# Altium schematic sheet 5V.SchDoc
size A4; SheetNumber: 2; SheetTotal: 4
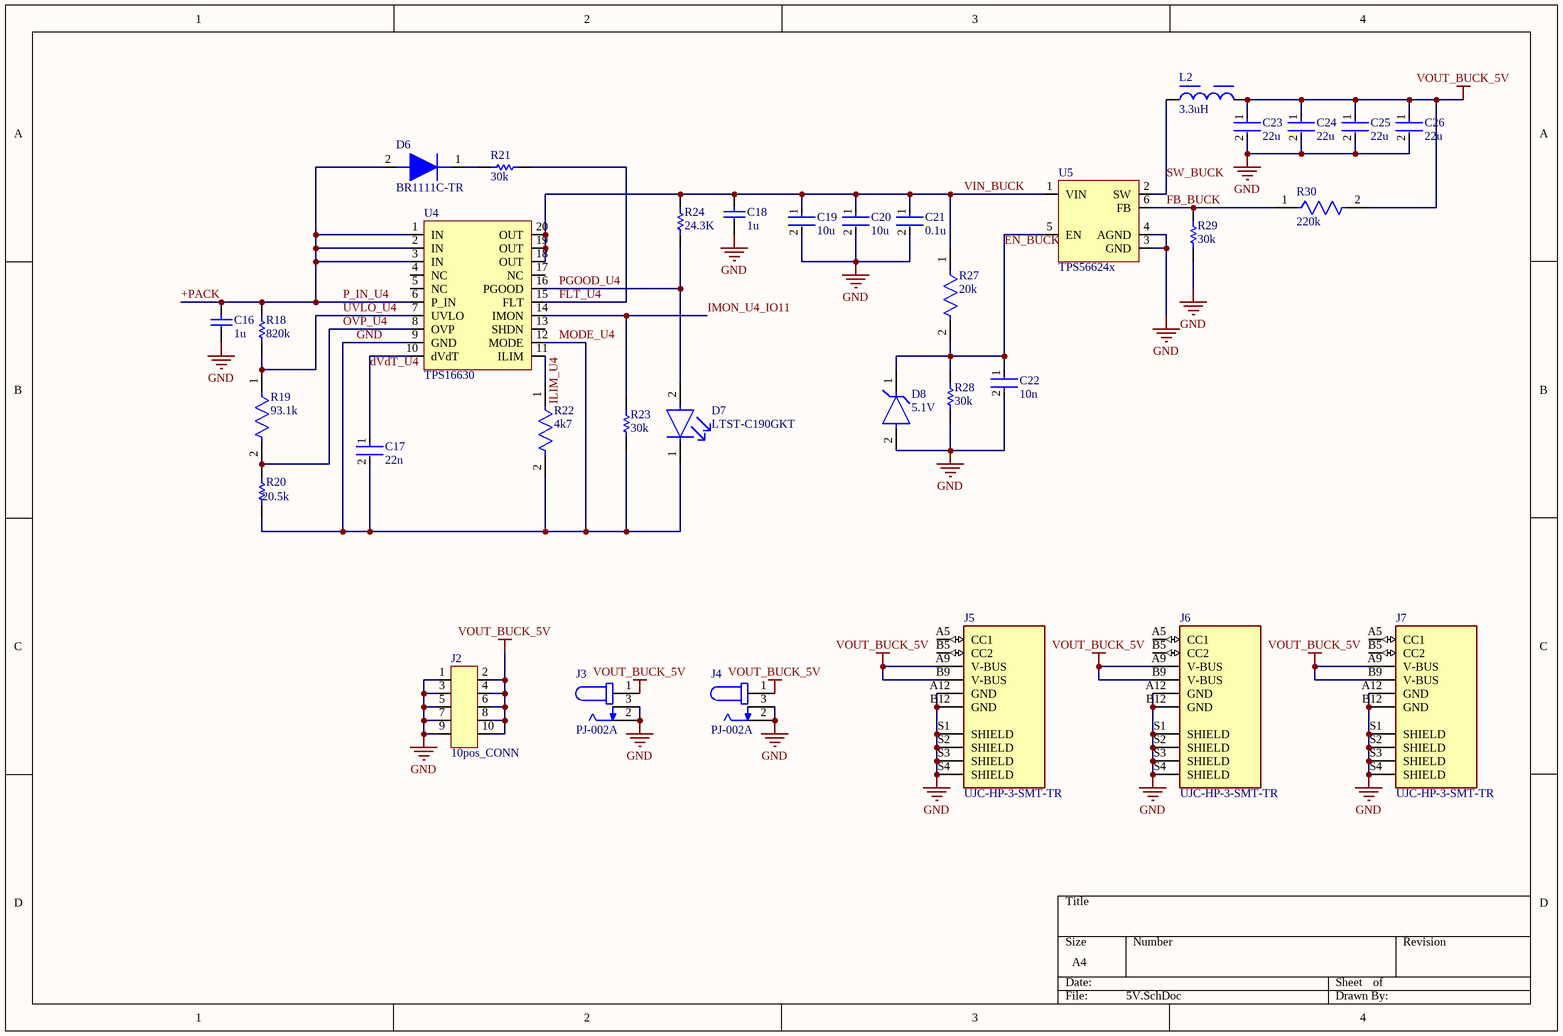
[diagram p0: 5V.SchDoc]

## Parts
C16  1u  [CAPC2013X140X50ML20T25]
C17  22n  [FP-C0603C-CF-MFG]
C18  1u  [CAPC2013X140X50ML20T25]
C19  10u  [FP-GRM21B-0_15-IPC_A]
C20  10u  [FP-GRM21B-0_15-IPC_A]
C21  0.1u  [FP-C0603C-CF-MFG]
C22  10n  [FP-C1608-080-0_1-MFG]
C23  22u  [FP-GRM21B-0_2-e0_2_0_7-IPC_C]
C24  22u  [FP-GRM21B-0_2-e0_2_0_7-IPC_C]
C25  22u  [FP-GRM21B-0_2-e0_2_0_7-IPC_C]
C26  22u  [FP-GRM21B-0_2-e0_2_0_7-IPC_C]
D6  BR1111C-TR  [LED_APHD1608LVBC/D]
D7  LTST-C190GKT  [FP-LTST-C190GKT-MFG]
D8  5.1V  [FP-SOD123-MFG]
J2  10pos_CONN  [61301021121]
J3  PJ-002A  [CUI_PJ-002A]
J4  PJ-002A  [CUI_PJ-002A]
J5  UJC-HP-3-SMT-TR  [CUI_UJC-HP-3-SMT-TR]
J6  UJC-HP-3-SMT-TR  [CUI_UJC-HP-3-SMT-TR]
J7  UJC-HP-3-SMT-TR  [CUI_UJC-HP-3-SMT-TR]
L2  3.3uH  [WE-HCI_1050]
R18  820k  [RESC1608X55X30ML15T15]
R19  93.1k  [FP-CR0805-IPC_B]
R20  20.5k  [RESC2013X60X40LL20T25]
R21  30k  [RESC1609X50X30ML10T20]
R22  4k7  [FP-RC1206-0_65-IPC_B]
R23  30k  [RESC1609X50X30ML10T20]
R24  24.3K  [RESC1609X50X30NL10T20]
R27  20k  [FP-CRCW0603-e3-IPC_C]
R28  30k  [RESC1609X50X30LL10T20]
R29  30k  [RESC1609X50X30LL10T20]
R30  220k  [FP-CRCW0603-HPe3-IPC_C]
U4  TPS16630  [SOP65P640X110-21N]
U5  TPS56624x  [SOT23_6pin]

## Nets
GND: C16.1 C17.2 C18.1 C19.2 C20.2 C21.2 C22.2 C23.2 C24.2 C25.2 C26.2 D7.1(C) D8.2(A) J2.1 J2.3 J2.5 J2.7 J2.9 J3.2 J3.3 J4.2 J4.3 J5.A12(GND) J5.B12(GND) J5.S1(SHIELD) J5.S2(SHIELD) J5.S3(SHIELD) J5.S4(SHIELD) J6.A12(GND) J6.B12(GND) J6.S1(SHIELD) J6.S2(SHIELD) J6.S3(SHIELD) J6.S4(SHIELD) J7.A12(GND) J7.B12(GND) J7.S1(SHIELD) J7.S2(SHIELD) J7.S3(SHIELD) J7.S4(SHIELD) R20.1 R22.2 R23.1 R28.1 R29.1 U4.9(GND) U4.12(MODE) U5.3(GND) U5.4(AGND)  [also labelled MODE_U4]
VOUT_BUCK_5V: C23.1 C24.1 C25.1 C26.1 J2.2 J2.4 J2.6 J2.8 J2.10 J3.1 J4.1 J5.A9(V-BUS) J5.B9(V-BUS) J6.A9(V-BUS) J6.B9(V-BUS) J7.A9(V-BUS) J7.B9(V-BUS) L2.2 R30.2
+PACK: C16.2 D6.2 R18.2 U4.1(IN) U4.2(IN) U4.3(IN) U4.6(P_IN)  [also labelled P_IN_U4]
dVdT_U4: C17.1 U4.10(dVdT)
EN_BUCK: C22.1 D8.1(C) R27.2 R28.2 U5.5(EN)
FB_BUCK: R29.2 R30.1 U5.6(FB)
FLT_U4: R21.1 U4.15(FLT)
ILIM_U4: R22.1 U4.11(ILIM)
IMON_U4_IO11: R23.2 U4.14(IMON)
OVP_U4: R19.2 R20.2 U4.8(OVP)
PGOOD_U4: D7.2(A) R24.1 U4.16(PGOOD)
SW_BUCK: L2.1 U5.2(SW)
UVLO_U4: R18.1 R19.1 U4.7(UVLO)
VIN_BUCK: C18.2 C19.1 C20.1 C21.1 R24.2 R27.1 U4.18(OUT) U4.19(OUT) U4.20(OUT) U5.1(VIN)
NetD6_1: D6.1 R21.2

Not connected (* = marked no-connect by the designer): J5 A5(CC1) B5(CC2); J6 A5(CC1) B5(CC2); J7 A5(CC1) B5(CC2); U4 4(NC) 5(NC) 13(SHDN) 17(NC)

## Library data of the parts
C16 C18 = CMP-2007-03236-1: Manufacturer: Kemet; Part Number: C0805C105K5RACTU
C17 = CMP-2006-03139-2: Ceramic Capacitor 0.022Uf 16V, X7R, 10%, 0603, Full Reel; Manufacturer Part Number: C0603C223K4RACTU; Manufacturer: KEMET; Capacitance: 22,000 pF; Temperature Coefficient: 30ppm/°C; Automotive Grade: Grade 1; Value: 22,000 pF; Tolerance: 0.1; Category: Cap; RoHS: TRUE; Temperature Range High: +125°C; Octopart: https://octopart.com/c0603c223k4ractu-kemet-123286; Mouser Description: CAP CER 0.022UF 16V X7R 0603; Voltage Rating: 16 V; Device Class L1: Passive Components; Automotive: Yes; Height: 0.87mm; Device Class L3: Ceramic Capacitors; Package: C0603C-CF; Temperature Characteristic: X7R; Device Class L2: Capacitors; Material: Ceramic; Lead Free: Yes; ComponentLink2URL: https://api.kemet.com/component-edge/download/datasheet/C0603C100J5GACAUTO.pdf; Temperature Range Low: -55°C; Digikey Description: Ceramic Capacitor 0.022Uf 16V, X7R, 10%, 0603, Full Reel; Temperature: -55°C to +125°C; ComponentLink2Description: Datasheet
C19 C20 = CMP-06035-013048-1: Chip Multilayer Ceramic Capacitors for General Purpose, 0805, 10uF, X5R, 15%, 20%, 25V; Max Operating Temperature: 85°C; Package Quantity: 3000; Case/Package: 0805; Depth: 1.25mm; Case Code (Imperial): 0805; Termination: SMD/SMT; Width: 0.049inch; Packaging: Tape and Reel; Tolerance: 20%; Height: 1.25mm; Min Operating Temperature: -55°C; Capacitance: 10uF; Weight: 0.000335oz; Voltage Rating (DC): 25V; Dielectric: X5R; Length: 2mm; Thickness: 0.055inch; Voltage Rating: 25V; Resistor Type: Ceramic; Lead Free: Lead Free; Case Code (Metric): 2012; Mount: Surface Mount; REACH SVHC: No SVHC
C21 = CMP-03020-003352-2: CAP CER 0.1UF 25V X7R 0603; Manufacturer: KEMET; Manufacturer Part Number: C0603C104J3RACAUTO; Value: 0.10 μF; Temperature Coefficient: 30ppm/°C; Automotive Grade: Grade 1; Tolerance: 0.05; Material: Ceramic; Temperature: -55°C to +125°C; Device Class L2: Capacitors; Device Class L1: Passive Components; Package: C0603C-CF; Octopart: https://octopart.com/c0603c104j3racauto-kemet-20761058; Temperature Range High: +125°C; Temperature Range Low: -55°C; Voltage Rating: 25 V; Height: 0.87mm; ComponentLink2URL: https://api.kemet.com/component-edge/download/datasheet/C0603C100J5GACAUTO.pdf; Automotive: Yes; Temperature Characteristic: X7R; RoHS: TRUE; Capacitance: 0.10 μF; Device Class L3: Ceramic Capacitors; Lead Free: Yes; Mouser Description: Cap Ceramic 0.1uF 25V X7R 5% Pad SMD 0603 125C Automotive T/R; ComponentLink2Description: Datasheet; Category: Cap; Digikey Description: CAP CER 0.1UF 25V X7R 0603
C22 = CMP-2000-06026-2: Multilayer Ceramic Capacitors 10nF ±10% 50V X7R SMD 0603; Voltage: 50V; Depth: 0.8mm; REACH SVHC: No SVHC; Packaging: Tape and Reel; Dielectric Material: Ceramic; Dielectric: X7R; Min Operating Temperature: -55°C; Package Quantity: 1; Width: 0.031inch; Case Code (Imperial): 0603; Radiation Hardening: No; Length: 1.6mm; RoHS Compliant: Yes; Tolerance: 10%; Termination: SMD/SMT; Mount: Surface Mount; Construction: Flat; Resistor Type: Ceramic; Max Operating Temperature: 125°C; Series: C; Lead Free: Lead Free; Capacitance: 10nF; Voltage Rating (DC): 50V; Thickness: 0.037inch; Voltage Rating: 50V; Height: 0.8mm; Weight: 7.1E-05oz; Case/Package: 0603; Case Code (Metric): 1608
C23-C26 = CMP-06035-039918-1: Chip Multilayer Ceramic Capacitors for General Purpose, 0805, 22uF, X5R, 15%, 20%, 10V; Dissipation Factor: 0.035%; Min Operating Temperature: -55°C; Voltage Rating (DC): 10V; Height: 1.25mm; Depth: 1.25mm; Max Operating Temperature: 85°C; Width: 1.25mm; Lead Free: Lead Free; Dielectric Material: Ceramic; Weight: 0.000335oz; Tolerance: 20%; Voltage Rating: 10V; Case Code (Metric): 2012; Termination: SMD/SMT; Length: 2mm; Thickness: 0.057inch; Case/Package: 0805; Packaging: Tape and Reel; Voltage: 10V; Case Code (Imperial): 0805; Resistor Type: Ceramic; Package Quantity: 3000; Mount: Surface Mount; Capacitance: 22uF; Dielectric: X5R
D7 = CMP-22017-000005-2: LED GREEN CLEAR CHIP SMD; Dominant Wavelength: 569nm; Reverse Voltage: 5V; Lens Color: Colorless; Viewing Angle: 130°; Voltage: 2V; Forward Current: 30mA; Power Dissipation: 100mW; Luminous Intensity: 6mcd; Number of LEDs: 1; Forward Voltage: 2.1V; Wavelength: 565nm; Test Current: 10mA; Min Operating Temperature: -55°C; Lens Style: Clear; Mount: Surface Mount; Width: 0.8mm; Packaging: Tape and Reel; Lens Transparency: Clear; Case Code (Metric): 1608; Depth: 0.8mm; Case Code (Imperial): 0603; Case/Package: 0603; Number of Pins: 2; Max Operating Temperature: 85°C; Lead Free: Lead Free; Number of Elements: 1; Length: 1.6mm; Height: 0.8mm; Package Quantity: 1; Power Rating: 100mW; Radiation Hardening: No; Illumination Color: Green; Color: Green
D8 = CMP-12792-000005-1: DIODE ZENER 5.1V 500MW SOD123; Manufacturer: Diodes; Manufacturer Part Number: MMSZ5231B-7-F; Standoff Height: 0mm; Max Zener Voltage: 5.36V; Max Reverse Leakage Current: 5uA; Max Junction Temp: +150°C; Power Dissipation: 370mW; Zener Impedance: 17Ω; Temperature: -65°C to +150°C; RoHS: TRUE; ComponentLink2Description: Datasheet; Octopart: https://octopart.com/mmsz5231b-7-f-diodes+inc.-55400050; Height: 1.45mm; ComponentLink2URL: https://www.diodes.com/assets/Datasheets/ds18010.pdf; Footprint Url: https://www.diodes.com/assets/Package-Files/SOD123.pdf; Device Class L2: Diodes; Nom Zener Voltage: 5.1V; Temperature Range Low: -65°C; Mouser Description: Zener Diodes 5.1V 500mW; Digikey Description: DIODE ZENER 5.1V 500MW SOD123; Device Class L1: Discrete Semiconductors; Device Class L3: Zener Diodes; Lead Free: Yes; Category: Diode; Automotive: No; Package: SOD123; Temperature Range High: +150°C
J3 J4 = PJ-002A: 2.0 x 6.5 mm, 2.5 A, Horizontal, Through Hole, Dc Power Jack Connector; MF: CUI Devices; MP: PJ-002A; Check_prices: https://www.snapeda.com/parts/PJ-002A/CUI+Devices/view-part/?ref=eda; Availability: In Stock; CUI_purchase_URL: https://www.cuidevices.com/product/interconnect/connectors/dc-power-connectors/jacks/pj-002a?utm_source=snapeda.com&utm_medium=referral&utm_campaign=snapedaBOM; SnapEDA_Link: https://www.snapeda.com/parts/PJ-002A/CUI+Devices/view-part/?ref=snap; Purchase-URL: https://pricing.snapeda.com/search/part/PJ-002A/?ref=eda; Price: None; Package: None; Value: *
J5-J7 = UJC-HP-3-SMT-TR: Type C, 3 A, Right Angle, Surface Mount (SMT), Power-Only USB Receptacle; Value: *; Availability: Unavailable; Price: None; Package: None; MP: UJC-HP-3-SMT-TR
L2 = CMP-0226-00130-2: NexarPartId: 8917368; Inductance: 3.3µH; Max DC Current: 12A; Series Resistance: 6.49mΩ; DC Resistance (DCR): 5.9mΩ; Self Resonant Frequency: 54MHz; Inductance Tolerance: 20%; Saturation Current: 5A; Test Frequency: 100kHz; Shielding: Shielded; Mount: Surface Mount; Packaging: Digi-Reel®; Termination: SMD/SMT; Ambient Temperature Range High: 100°C; Max Operating Temperature: 150°C; Case/Package: Nonstandard; Ambient Temperature Range Low: -40°C; Current Rating: 12A; Resistance: 5.9mΩ; Min Operating Temperature: -40°C; RMS Current (Irms): 12A; Number of Pins: 2; Height: 4.7mm; Width: 10.2mm; Tolerance: 20%; Composition: Wirewound; REACH SVHC: Unknown; Length: 10.5mm; Height - Seated (Max): 5.0038mm; Depth: 10.2mm; RoHS: Compliant
R18 = CMP-2000-00657-1: Manufacturer: Panasonic; Part Number: ERJ3EKF8203V
R19 = CMP-07231-005357-1: Thick Film Chip Resistors 0805 93.1kΩ 0.125W 1% 100ppm/°C; Resistance: 93.1kR; Voltage Rating: 150V; Power Rating: 125mW; Number of Terminations: 2; Max Operating Temperature: 155°C; Tolerance: 1%; Width: 0.049inch; Termination: SMD/SMT; Case Code (Imperial): 0805; Mount: Surface Mount; Depth: 1.25mm; Case Code (Metric): 2012; Package Quantity: 5000; Case/Package: 0805; Composition: Thick Film; Thickness: 508um; Military Standard: Not; Contact Plating: Tin; Temperature Coefficient: 100ppm/°C; Features: Moisture Resistant; Height: 0.024inch; Length: 2mm; Min Operating Temperature: -55°C; Radiation Hardening: No; Max Power Dissipation: 125mW; Packaging: Tape and Reel
R20 = CMP-2001-00767-1: Manufacturer: Panasonic; Part Number: ERA6AEB2052V
R21 R23 = CMP-2000-03224-1: Manufacturer: Vishay Dale; Part Number: CRCW060330K0JNEA
R22 = CMP-03412-037805-1: RES SMD 4.7K OHM 1% 1/4W 1206; Max Power Dissipation: 250mW; Voltage Rating: 200V; Temperature Coefficient: 100ppm/°C; Resistance: 4.7kR; Construction: Rectangular; RoHS Compliant: Yes; Max Operating Temperature: 155°C; Tolerance: 1%; Height: 0.026inch; Features: Moisture Resistant; Military Standard: Not; Series: RC; Termination: SMD/SMT; Number of Terminations: 2; Number of Pins: 2; Case Code (Imperial): 1206; Case/Package: 1206; Case Code (Metric): 3216; Voltage Rating (DC): 200V; Width: 0.063inch; Min Operating Temperature: -55°C; Resistance Tolerance: 1%; Length: 0.122inch; Size Code: 1206; Lead Free: Lead Free; Depth: 1.6mm; Packaging: Tape and Reel; Package Quantity: 1; Power Rating: 250mW; Resistor Type: Thick Film
R24 = CMP-2000-03120-1: Part Number: CRCW060324K3FKEA; Manufacturer: Vishay Dale
R27 = CMP-2000-03068-2: RES Thick Film, 20kΩ, 1%, 0.1W, 100ppm/°C, 0603; Voltage Rating: 75V; Power Rating: 100mW; Resistance: 20kR; Lead Free: Lead Free; Depth: 0.85mm; Case Code (Metric): 1608; Contact Plating: Tin; Max Operating Temperature: 155°C; Package Quantity: 5000; Length: 1.55mm; Min Operating Temperature: -55°C; Composition: Thick Film; Case/Package: 0603; Packaging: Tape and Reel; Tolerance: 1%; Width: 0.85mm; Termination: SMD/SMT; Military Standard: Not; Case Code (Imperial): 0603; Voltage Rating (DC): 75V; Temperature Coefficient: 100ppm/°C; Radiation Hardening: No; Weight: 7.1E-05oz; Height: 0.45mm; Number of Pins: 2; Mount: Surface Mount
R28 R29 = CMP-2000-03223-1: Part Number: CRCW060330K0FKEA; Manufacturer: Vishay Dale
R30 = CMP-02407-002423-1: RES Thick Film, 220kΩ, 1%, 0.33W, 100ppm/°C, 0603; Max Power Dissipation: 250mW; Resistance: 220kR; Height: 0.022inch; Features: Automotive AEC-Q200; Temperature Coefficient: 100ppm/°C; Packaging: Tape and Reel; Contact Plating: Tin; Package Quantity: 5000; Mount: Surface Mount; Length: 0.063inch; Termination: Wraparound; Power Rating: 250mW; Case Code (Imperial): 0603; Composition: Thick Film; Case Code (Metric): 1608; Min Operating Temperature: -55°C; Tolerance: 1%; Max Operating Temperature: 155°C; Number of Terminations: 2; Case/Package: 0603; Lead Free: Lead Free; Width: 0.033inch